# Altium schematic sheet 12_IO.SchDoc
size A4
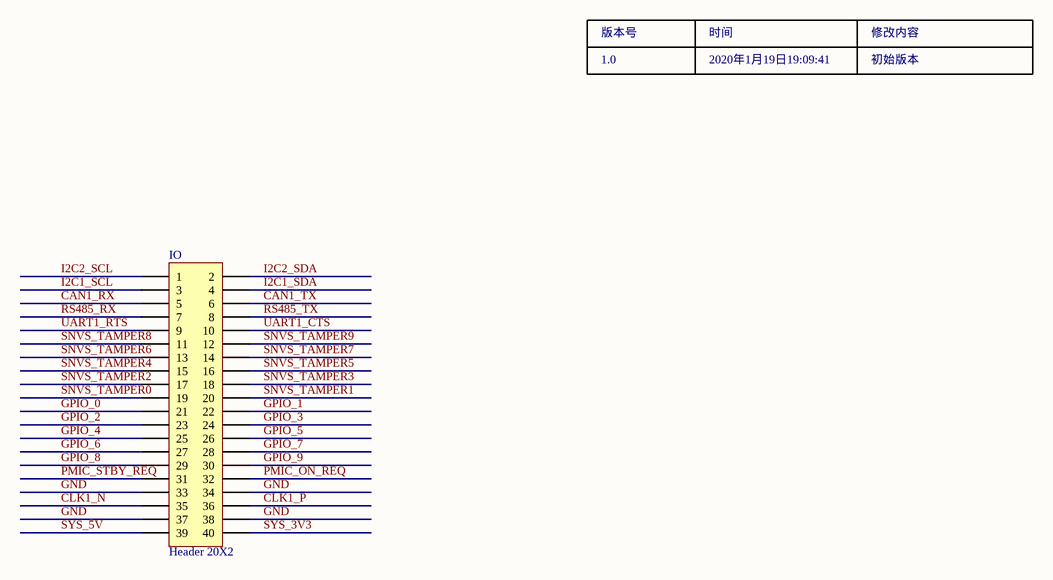
[diagram p0: 12_IO.SchDoc]

## Parts
IO  Header 20X2  [HDR2X20]

## Nets
CAN1_RX: IO.5
CAN1_TX: IO.6
CLK1_N: IO.35
CLK1_P: IO.36
GND: IO.33 IO.34 IO.37 IO.38
GPIO_0: IO.21
GPIO_1: IO.22
GPIO_2: IO.23
GPIO_3: IO.24
GPIO_4: IO.25
GPIO_5: IO.26
GPIO_6: IO.27
GPIO_7: IO.28
GPIO_8: IO.29
GPIO_9: IO.30
I2C1_SCL: IO.3
I2C1_SDA: IO.4
I2C2_SCL: IO.1
I2C2_SDA: IO.2
PMIC_ON_REQ: IO.32
PMIC_STBY_REQ: IO.31
RS485_RX: IO.7
RS485_TX: IO.8
SNVS_TAMPER0: IO.19
SNVS_TAMPER1: IO.20
SNVS_TAMPER2: IO.17
SNVS_TAMPER3: IO.18
SNVS_TAMPER4: IO.15
SNVS_TAMPER5: IO.16
SNVS_TAMPER6: IO.13
SNVS_TAMPER7: IO.14
SNVS_TAMPER8: IO.11
SNVS_TAMPER9: IO.12
SYS_3V3: IO.40
SYS_5V: IO.39
UART1_CTS: IO.10
UART1_RTS: IO.9

## Notes on the sheet
- 版本号
- 1.0
- 2020年1月19日19:09:41
- 时间
- 修改内容
- 初始版本

## Library data of the parts
IO = Header 20X2: Header, 20-Pin, Dual row; LatestRevisionDate: 17-Jul-2002; LatestRevisionNote: Re-released for DXP Platform.; Publisher: Altium Limited